# EasyEDA Pro project avaruusantenni_tallylight.eprj, schematic Schematic2

## Sheets
1 MCU: Create Date: 2023-10-17; Page Name: MCU; Project Name: avaruusantenni_tallylight; Schematic Name: Schematic2; Update Date: 2023-12-20; Add into BOM: no; Company: EasyEDA.com; Drawed: EasyEDA Pro; Page Size: A4; Part Number: JLCPCB-002; Reviewed: EasyEDA Pro; Version: V0.1
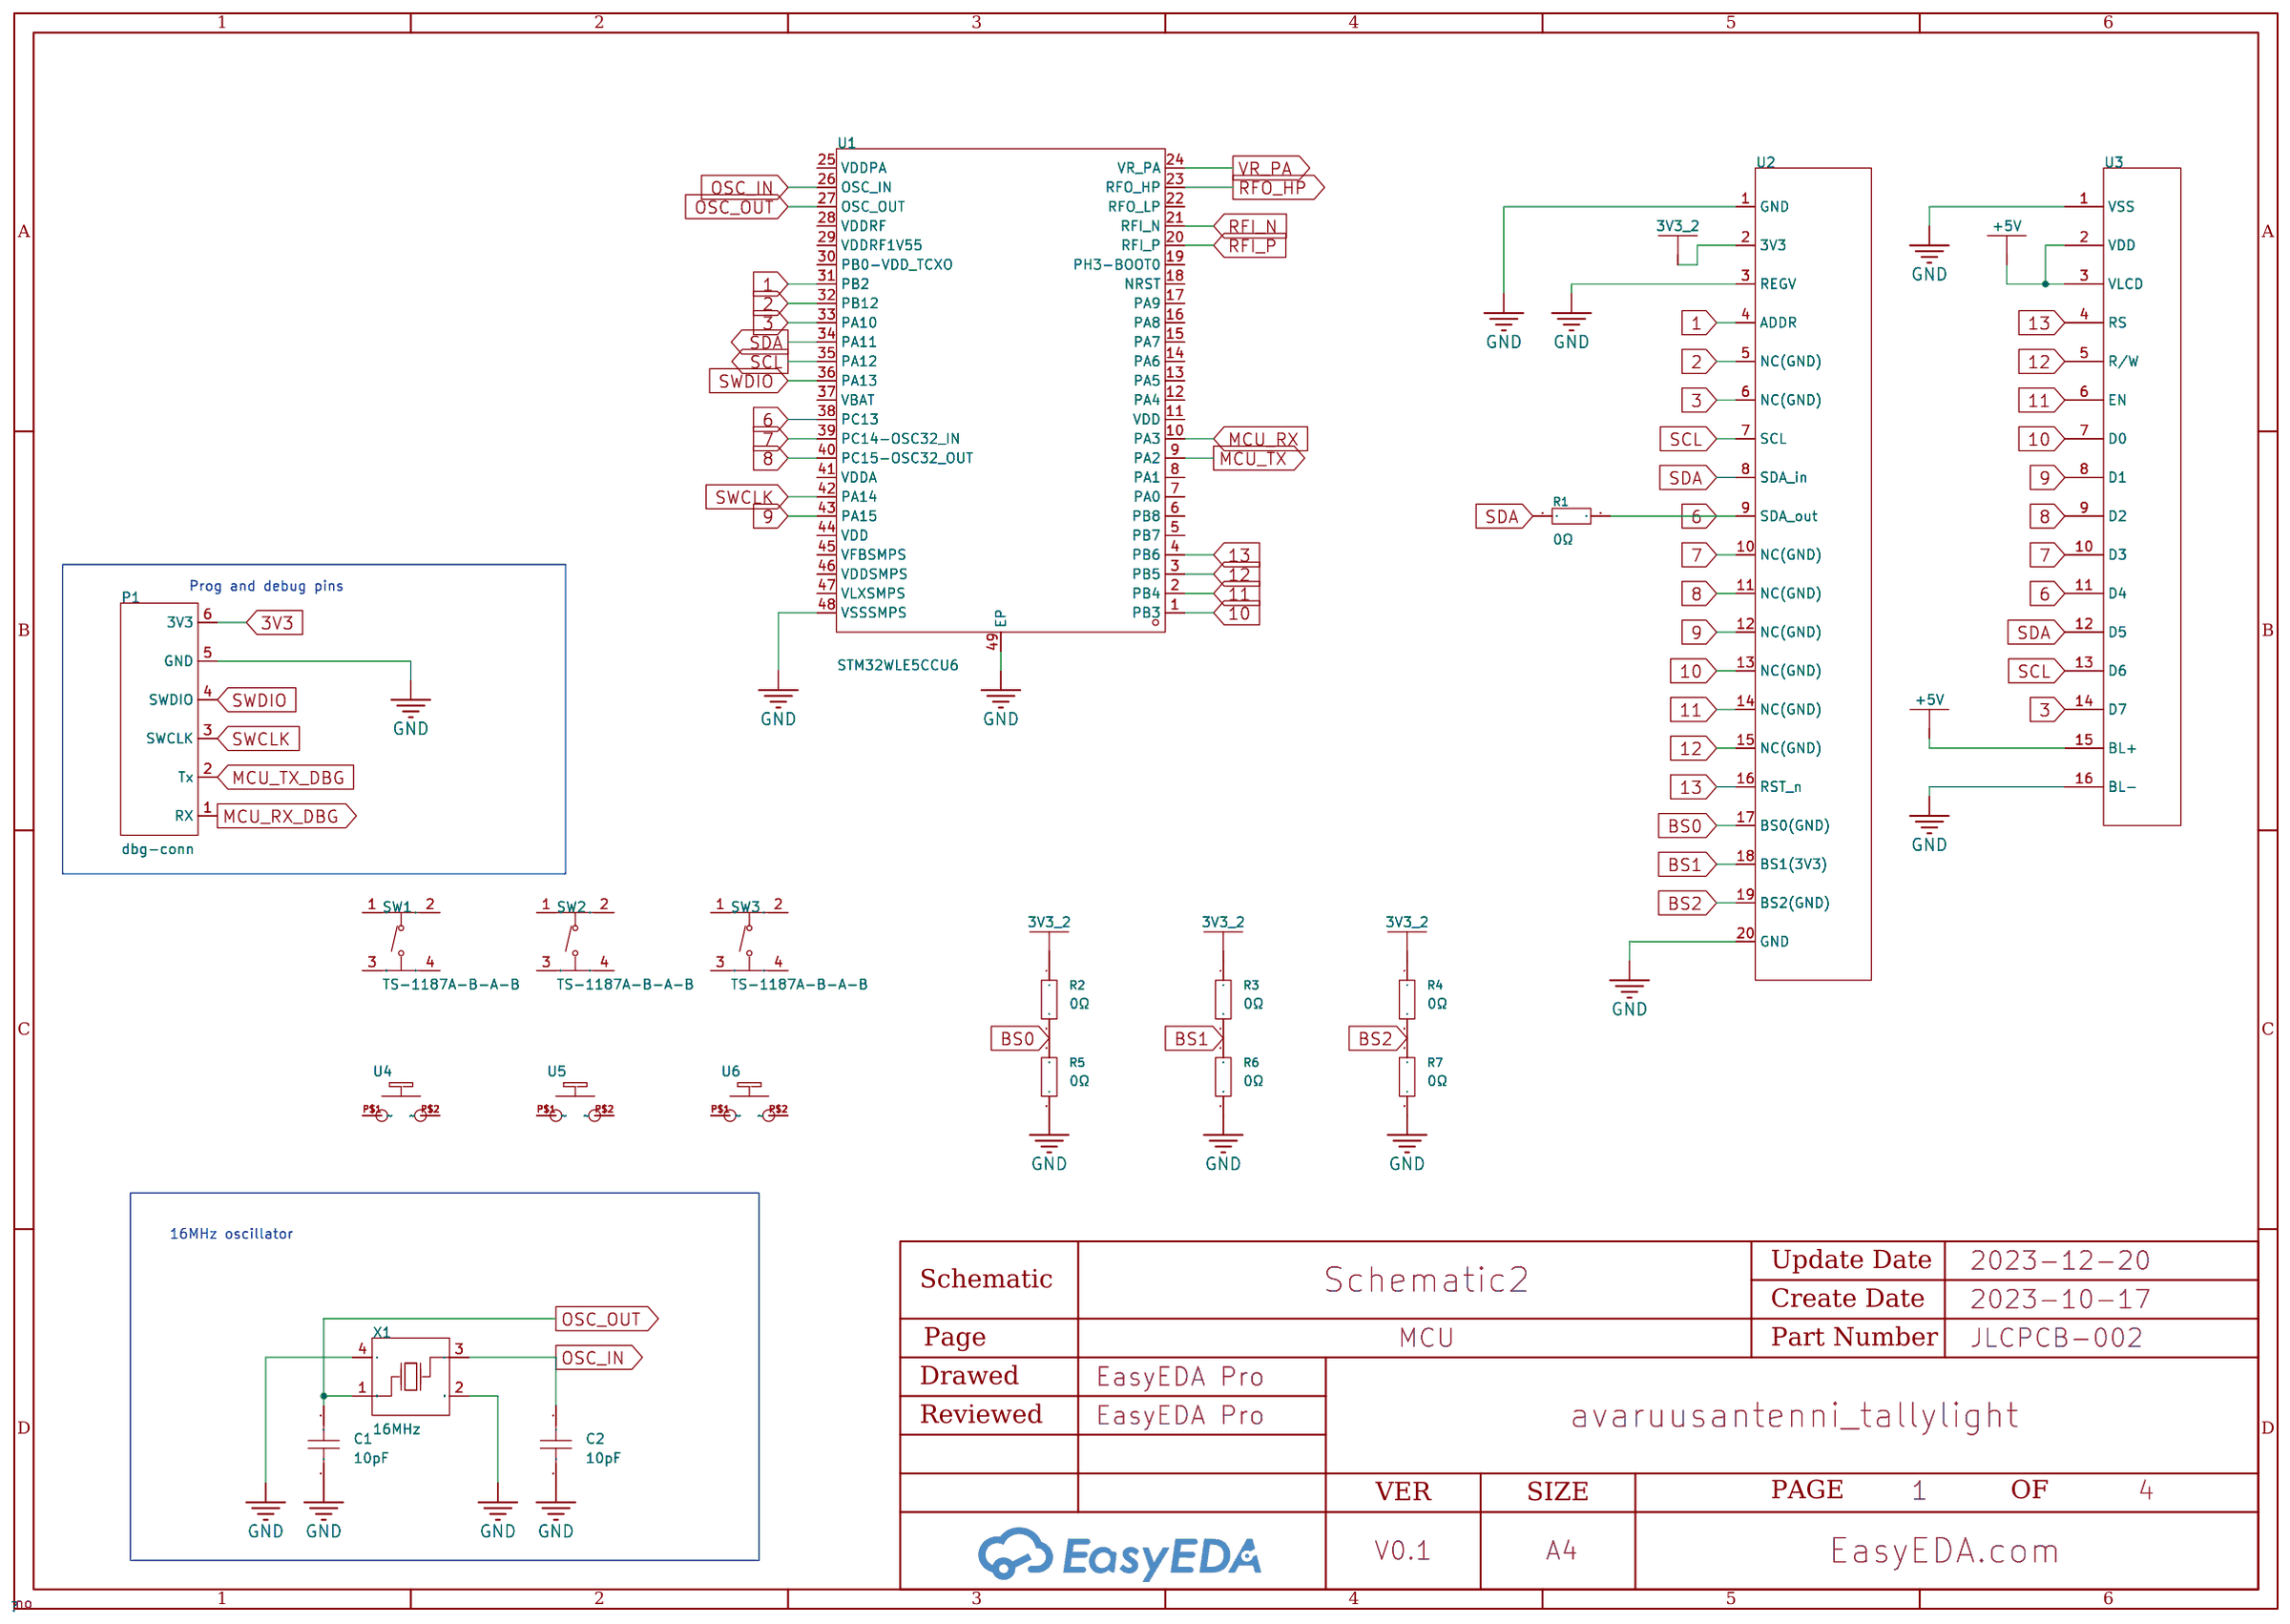
[diagram p3: MCU]
2 PWR: Page Name: PWR; Update Date: 2023-11-27
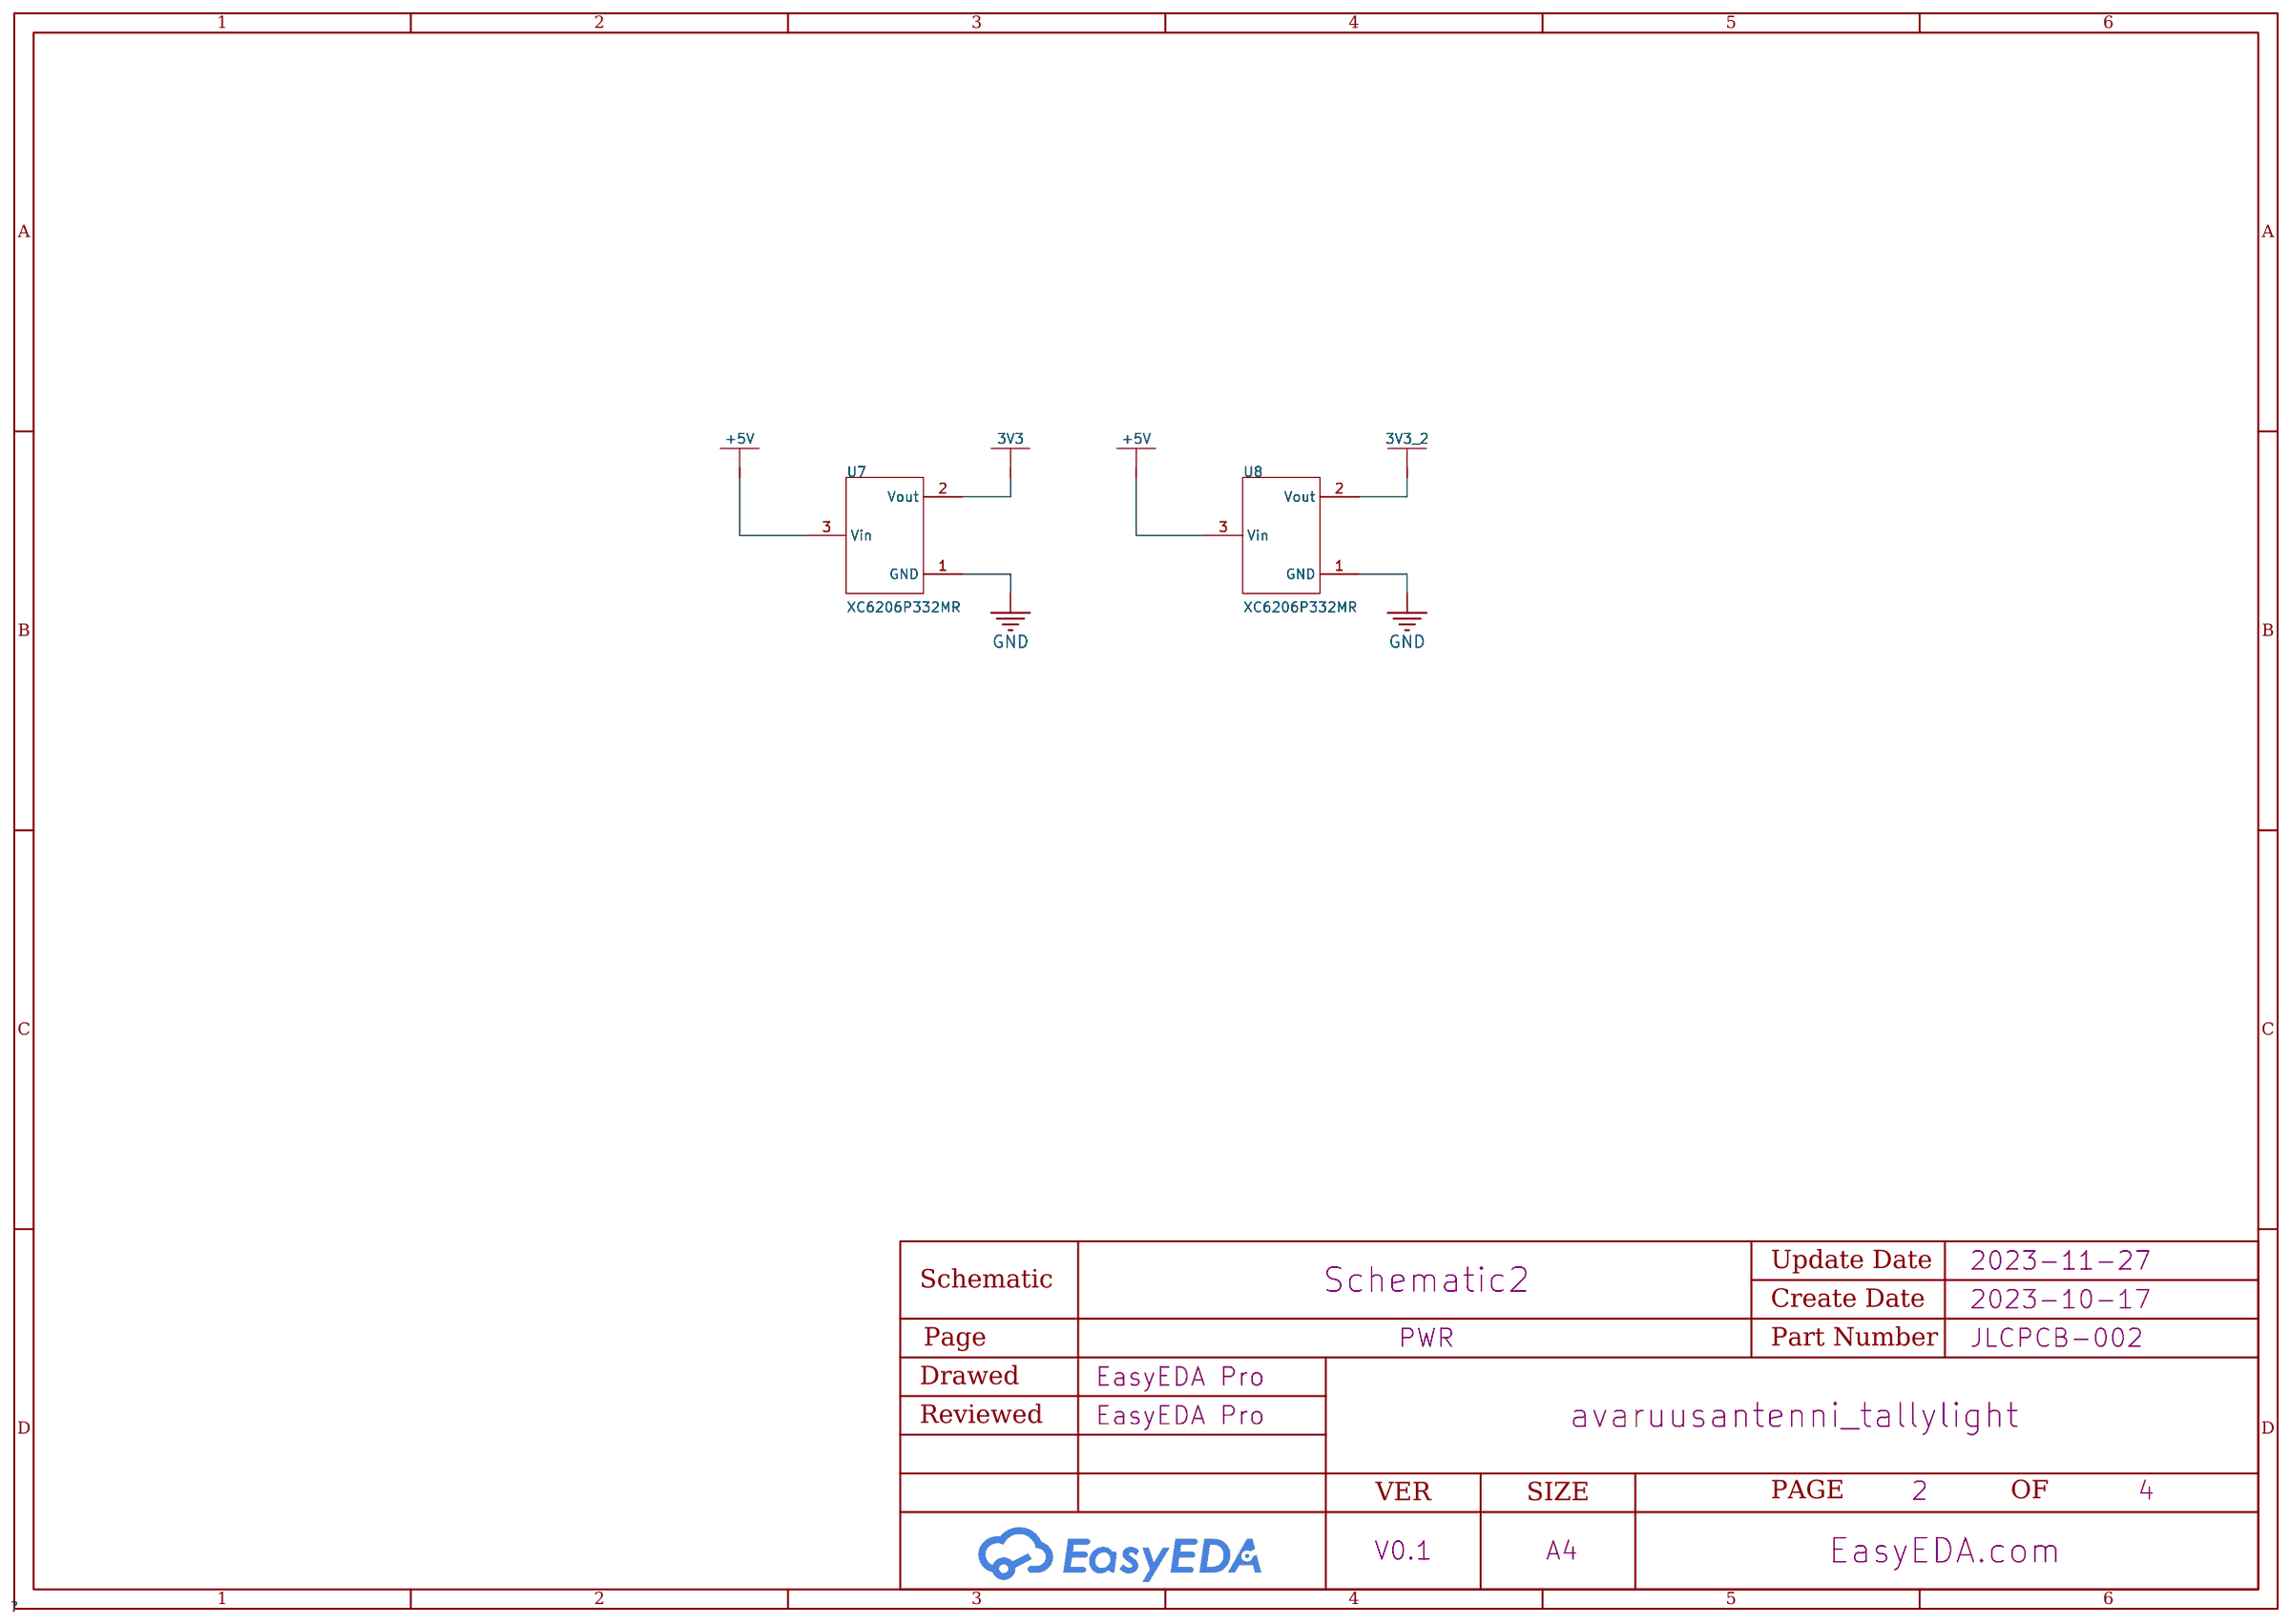
[diagram p4: PWR]
3 Serial: Page Name: Serial; Update Date: 2023-10-28
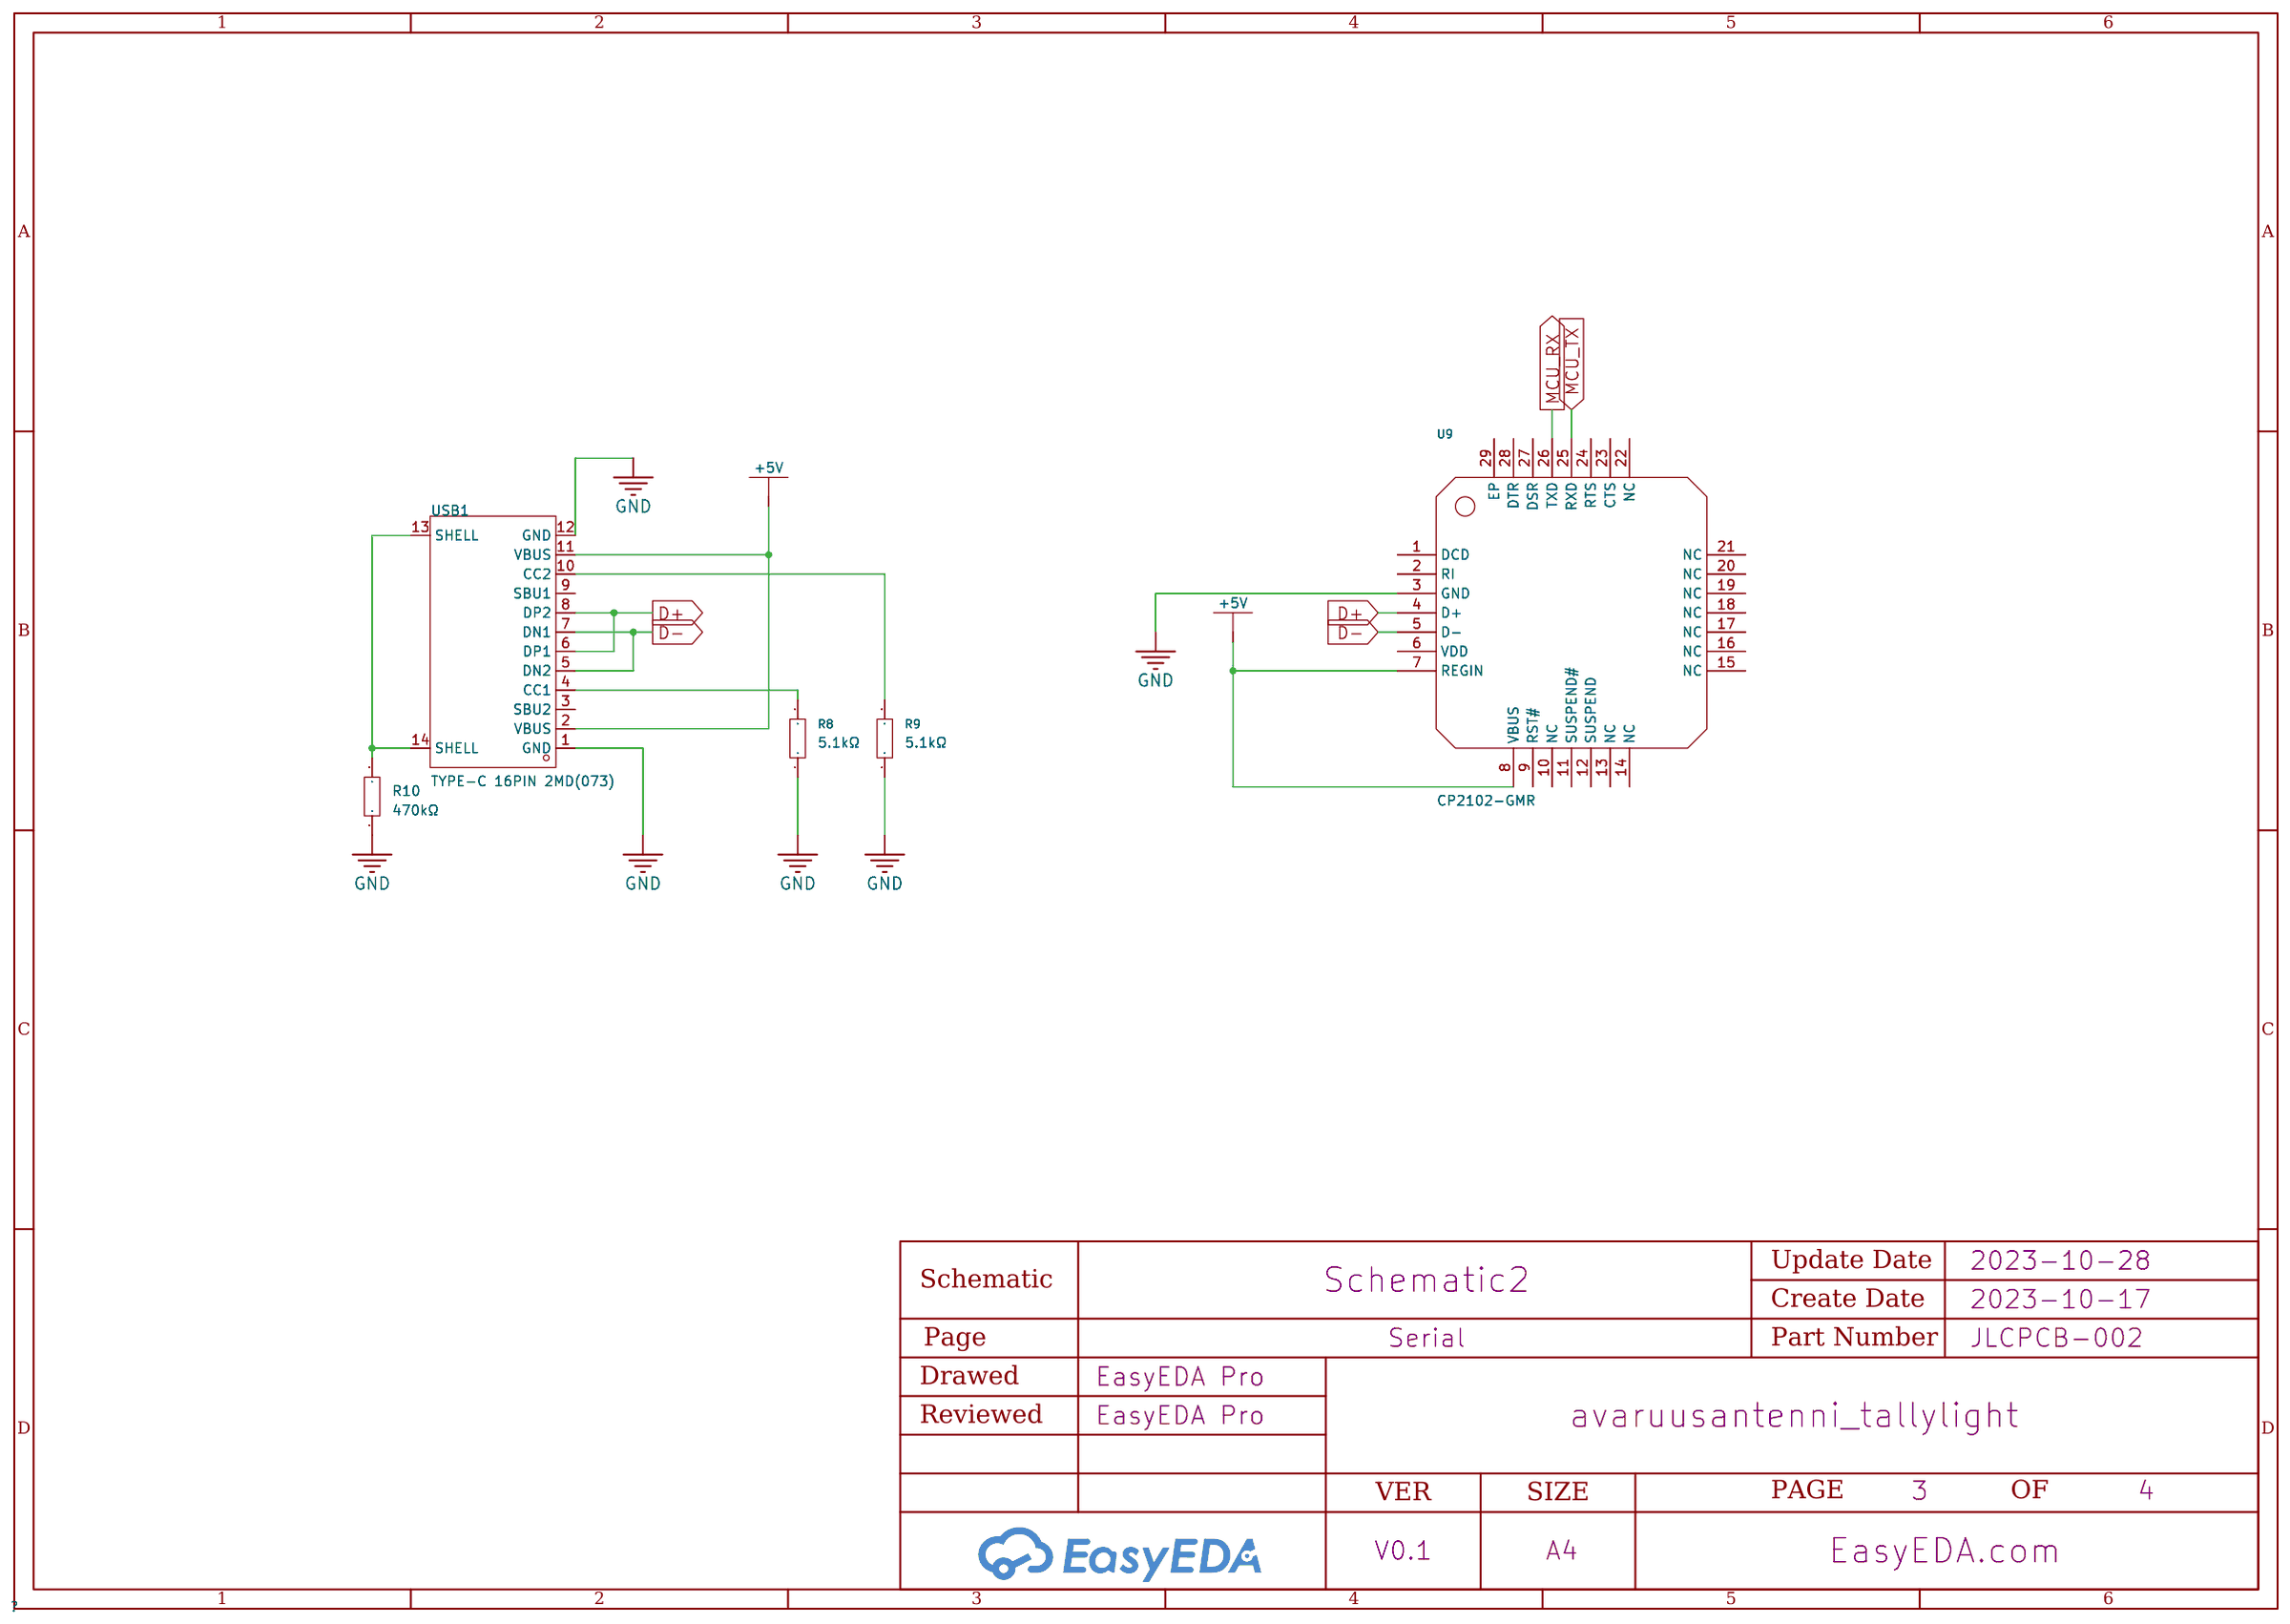
[diagram p5: Serial]
4 RF_Front: Page Name: RF_Front; Update Date: 2023-12-21
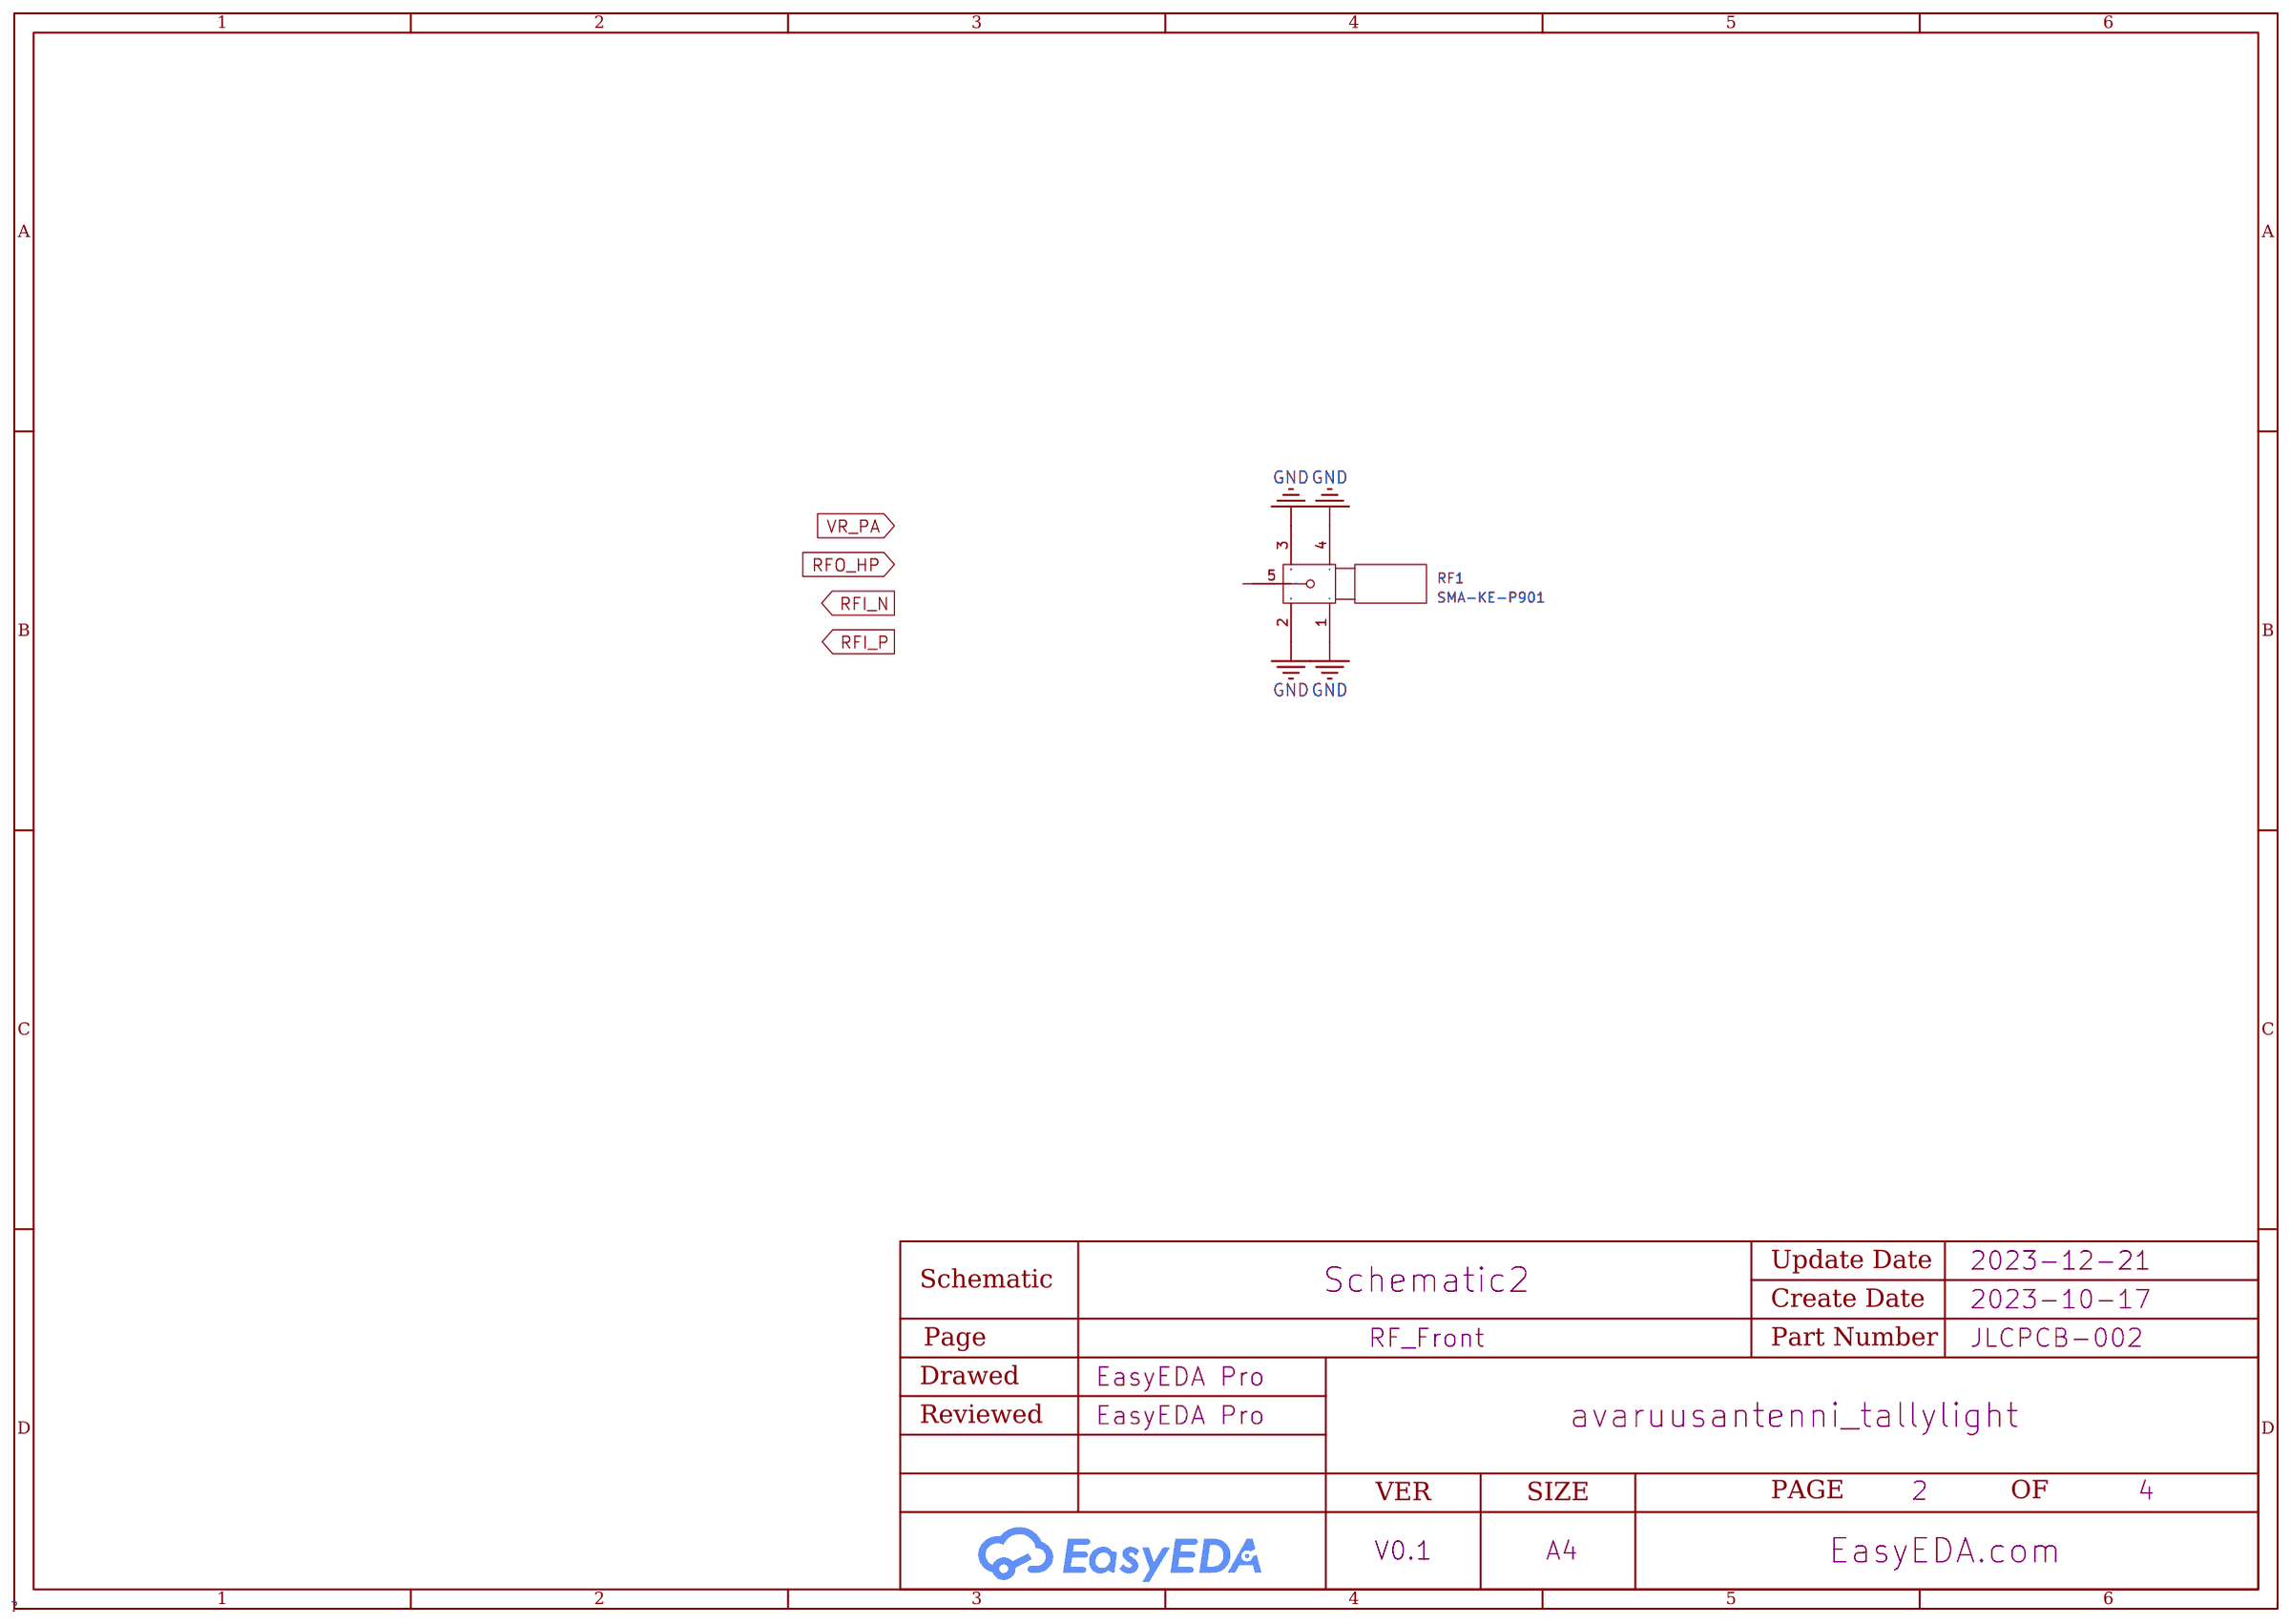
[diagram p6: RF_Front]

## Parts
sheet MCU
C1  10pF  [C0402]
C2  10pF  [C0402]
P1  dbg-conn  [AA-DBG-1x6-2.54]  (no BOM)
R1  0Ω  [R0603]
R2  0Ω  [R0603]  (no BOM)
R3  0Ω  [R0603]
R4  0Ω  [R0603]  (no BOM)
R5  0Ω  [R0603]
R6  0Ω  [R0603]  (no BOM)
R7  0Ω  [R0603]
SW1  TS-1187A-B-A-B  [SW-SMD_4P-L5.1-W5.1-P3.70-LS6.5-TL-2]
SW2  TS-1187A-B-A-B  [SW-SMD_4P-L5.1-W5.1-P3.70-LS6.5-TL-2]
SW3  TS-1187A-B-A-B  [SW-SMD_4P-L5.1-W5.1-P3.70-LS6.5-TL-2]
U1  STM32WLE5CCU6  [UFQFPN-48_L7.0-W7.0-P0.50-BL-EP5.6]
U2  -  [NewhavenOledModule]  (no BOM)
U3  -  [LCD_1602A]
U4  MX1A-11NN  [CHERRY_MX1A-11NN_SWITCH]  (no BOM)
U5  MX1A-11NN  [CHERRY_MX1A-11NN_SWITCH]  (no BOM)
U6  MX1A-11NN  [CHERRY_MX1A-11NN_SWITCH]  (no BOM)
X1  16MHz  [OSC-SMD_4P-L3.2-W2.5-BL]
sheet PWR
U7  XC6206P332MR  [SOT-23-3_L2.9-W1.6-P1.90-LS2.8-BR]
U8  XC6206P332MR  [SOT-23-3_L2.9-W1.6-P1.90-LS2.8-BR]
sheet RF_Front
CBB1  b29a9d25234149e2a3663a5b9bef8dd2
RF1  SMA-KE-P901  [SMA-TH_SMA-KE-P901]  (no BOM)
sheet Serial
R8  5.1kΩ  [R0402]
R9  5.1kΩ  [R0402]
R10  470kΩ  [R0603]
U9  CP2102-GMR  [WQFN-28_L5.0-W5.0-P0.50-BL-EP3.2]
USB1  TYPE-C 16PIN 2MD(073)  [USB-C-SMD_TYPE-C-6PIN-2MD-073]

## Library data of the parts
C1 C2 = CL05C100JB5NNNC: Capacitance: Tolerance:±5% Tolerance:±5% Voltage Rated: Temperature Coefficient:; LCSC Part Name: 10pF ±5% 50V; Supplier Part: C32949; Manufacturer: SAMSUNG(三星); Supplier Footprint: 0402; JLCPCB Part Class: Basic Part; Datasheet: https://atta.szlcsc.com/upload/public/pdf/source/20160103/1457707722238.pdf; Supplier: LCSC; Tolerance: ±5%
P1 = AA-DBG-1x6-L: The Avaruusantenni standard debug connector variant with a pin layout of 1 x 6 with 2.54 mm (100 mil) pitch
R1-R7 = 0603WAF0000T5E: Resistance: Tolerance:±1% Tolerance:±1% Power(Watts): Overload Voltage (Max): Type:Thick Film Resistors Operating Temperature Range:-55℃~+155℃ Operating Temperature Range:-55℃~+155℃; LCSC Part Name: 0Ω ±1% 100mW 厚膜电阻; Supplier Part: C21189; Manufacturer: UNI-ROYAL(厚声); Supplier Footprint: 0603; JLCPCB Part Class: Basic Part; Datasheet: https://atta.szlcsc.com/upload/public/pdf/source/20200306/C422600_1E6D84923E4A46A82E41ADD87F860B5C.pdf; Supplier: LCSC; Tolerance: ±1%; Type: Thick Film Resistors; Operating Temperature Range: -55℃~+155℃
SW1-SW3 = TS-1187A-B-A-B: Contact Current:50mA Voltage Rating (DC):12V Insulation Resistance:- Circuit:SPST Mounting Style:Brick nogging Actuator Style:Round Button Actuator/Cap Color:金色 With Lamp:No Operating Force:160gf Mechanical Life:100000次 Operating Temperature:-30℃~+85℃ Ope; LCSC Part Name: 5.1*5.1*1.5mm 立贴 轻触开关 防水金属头; Supplier Part: C318884; Manufacturer: XKB Connectivity(中国星坤); Supplier Footprint: SMD; JLCPCB Part Class: Basic Part; Datasheet: https://atta.szlcsc.com/upload/public/pdf/source/20200227/C318884_1F20165719E1C4CAA3E10C4C359C6E26.pdf; Supplier: LCSC; Contact Current: 50mA; Voltage Rating (DC): 12V; Circuit: SPST; Mounting Style: Brick nogging; Actuator Style: Round Button; Actuator/Cap Color: 金色; With Lamp: No; Operating Force: 160gf; Mechanical Life: 100000次; Operating Temperature: -30℃~+85℃; Switch Length: 5.1mm; Switch Width: 5.1mm; Switch Height: 1.5mm; Strike Gundam: NO
U1 = STM32WLE5CCU6: Supplier Part: C2888218; Manufacturer: ST(意法半导体); Supplier Footprint: UFQFPN-48(7x7); JLCPCB Part Class: Extended Part; Datasheet: https://atta.szlcsc.com/upload/public/pdf/source/20220805/73C544F8A874B6EECCDD18E2DF490EB3.pdf; Supplier: LCSC
U2 = NewhavenOled_i2c: i2c version of the 2x20 character oled module, 3.3V
U3 = LCD_1602A: 16x2 character parallel interface LCD module
U4-U6 = MX1A-11NN: \nSwitch,Key,SPST-NO,Keyboard,Low Profile,10mA,12VDC,Face Place Mount,Std Force | Cherry Americas MX1A-11NN\n; MF: Cherry; Price: None; SnapEDA_Link: https://www.snapeda.com/parts/MX1A-11NN/Cherry/view-part/?ref=snap; Purchase-URL: https://www.snapeda.com/api/url_track_click_mouser/?unipart_id=283337&amp;manufacturer=Cherry&amp;part_name=MX1A-11NN&amp;search_term=none; Availability: In Stock; Check_prices: https://www.snapeda.com/parts/MX1A-11NN/Cherry/view-part/?ref=eda
X1 = X322516MLB4SI: Crystal Type:SMD Crystal Resonator Frequency: Frequency Tolerance:±10ppm Frequency Tolerance:±10ppm Frequency Stability:±30ppm Frequency Stability:±30ppm Load Capacitance: Operating Temperature: Operating Temperature:; LCSC Part Name: 16MHz ±10ppm 9pF YSX321SL; Supplier Part: C13738; Manufacturer: YXC(扬兴晶振); Supplier Footprint: SMD3225-4P; JLCPCB Part Class: Basic Part; Datasheet: https://atta.szlcsc.com/upload/public/pdf/source/20210329/C112971_1F611BDC486E193C1706F6D8EB5AA189.pdf; Supplier: LCSC; Crystal Type: SMD Crystal Resonator; Frequency Tolerance: ±10ppm; Frequency Stability: ±30ppm
U7 U8 = XC6206P332MR_C5446: Output Type: Output Polarity:Positive Number of Outputs:1 Maximum Input Voltage:6V Output Voltage:3.3V~3.3V Output Voltage:3.3V~3.3V Dropout Voltage:680mV@(100mA) Output Current:200mA Power Supply Rejection Ratio (PSRR):-; Supplier Part: C5446; Manufacturer: TOREX(特瑞仕); Supplier Footprint: SOT-23-3L; JLCPCB Part Class: Basic Part; Datasheet: https://atta.szlcsc.com/upload/public/pdf/source/20130801/1457706628791.pdf; Supplier: LCSC; Output Polarity: Positive; Number of Outputs: 1; Maximum Input Voltage: 6V; Output Voltage: 3.3V~3.3V; Dropout Voltage: 680mV@(100mA); Output Current: 200mA
RF1 = SMA-KE-P901: Connector Type:板端 RF Series:RP-SMA Interface Type:内针 Number of Ports:1 Impedance:50Ω Frequency-Max:3GHz Style:偏脚 Interface Diameter:5.35mm Interface Length/Height:- Operating Temperature Range:-55℃~+125℃ Operating Temperature Range:-55℃~+125℃; LCSC Part Name: RP-SMA 内针 偏脚; Supplier Part: C914556; Manufacturer: DreamLNK(骏晔科技); Supplier Footprint: 插件; JLCPCB Part Class: Extended Part; Datasheet: https://atta.szlcsc.com/upload/public/pdf/source/20201104/C914556_6716DB066E64EC6AFA3017BF070429A4.pdf; Supplier: LCSC; Connector Type: 板端; RF Series: RP-SMA; Interface Type: 内针; Number of Ports: 1; Impedance: 50Ω; Frequency-Max: 3GHz; Style: 偏脚; Interface Diameter: 5.35mm; Operating Temperature Range: -55℃~+125℃
R8 R9 = 0402WGF5101TCE: Type:Thick Film Resistors Resistance: Tolerance:±1% Tolerance:±1% Power(Watts): Temperature Coefficient:±100ppm/℃ Temperature Coefficient:±100ppm/℃ Overload Voltage (Max): Operating Temperature Range:-55℃~+155℃ Operating Temperature Range:-55℃~+155℃; LCSC Part Name: 5.1kΩ ±1% 62.5mW; Supplier Part: C25905; Manufacturer: UNI-ROYAL(厚声); Supplier Footprint: 0402; JLCPCB Part Class: Basic Part; Datasheet: https://atta.szlcsc.com/upload/public/pdf/source/20200306/C422600_1E6D84923E4A46A82E41ADD87F860B5C.pdf; Supplier: LCSC; Type: Thick Film Resistors; Tolerance: ±1%; Temperature Coefficient: ±100ppm/℃; Operating Temperature Range: -55℃~+155℃
R10 = 0603WAF4703T5E: Type:Thick Film Resistors Resistance: Tolerance:±1% Tolerance:±1% Power(Watts): Temperature Coefficient:±100ppm/℃ Temperature Coefficient:±100ppm/℃ Overload Voltage (Max): Operating Temperature Range:-55℃~+155℃ Operating Temperature Range:-55℃~+155℃; LCSC Part Name: 470kΩ ±1% 100mW; Supplier Part: C23178; Manufacturer: UNI-ROYAL(厚声); Supplier Footprint: 0603; JLCPCB Part Class: Basic Part; Datasheet: https://atta.szlcsc.com/upload/public/pdf/source/20200306/C422600_1E6D84923E4A46A82E41ADD87F860B5C.pdf; Supplier: LCSC; Type: Thick Film Resistors; Tolerance: ±1%; Temperature Coefficient: ±100ppm/℃; Operating Temperature Range: -55℃~+155℃
U9 = CP2102-GMR: Applications Function:Transceiver Protocol: Data Rate:1Mbps Supply Voltage:3V~3.6V Supply Voltage:3V~3.6V; Supplier Part: C6568; Manufacturer: SILICON LABS(芯科); Supplier Footprint: WQFN-28-EP(5x5); JLCPCB Part Class: Basic Part; Datasheet: https://atta.szlcsc.com/upload/public/pdf/source/20170103/1483439882795.pdf; Supplier: LCSC; Applications Function: Transceiver; Data Rate: 1Mbps; Supply Voltage: 3V~3.6V
USB1 = TYPE-C 16PIN 2MD(073): Connector Type:Type-C Standard:- Gender:Female Number of Contacts:16 Number of Ports:1 Mounting Style:Surface Mount Current Rating - Power (Max):5A Operating Temperature Range:-25℃~+85℃ Operating Temperature Range:-25℃~+85℃; LCSC Part Name: TYPE-C母座 16P 4脚插件带定位柱 不锈钢外壳 2次模顶; Supplier Part: C2765186; Manufacturer: SHOU HAN(首韩); Supplier Footprint: SMD; JLCPCB Part Class: Extended Part; Supplier: LCSC; Connector Type: Type-C; Gender: Female; Number of Contacts: 16; Number of Ports: 1; Mounting Style: Surface Mount; Current Rating - Power (Max): 5A; Operating Temperature Range: -25℃~+85℃

## Nets
3V3: P1.6(3V3) U7.2(Vout)
3V3_2: R2.1 R3.1 R4.1 U2.2(3V3) U8.2(Vout)
+5V: U3.2(VDD) U3.3(VLCD) U3.15(BL+) U7.3(Vin) U8.3(Vin) U9.7(REGIN) U9.8(VBUS) USB1.2(VBUS) USB1.11(VBUS)
GND: C1.1 C2.2 P1.5(GND) R5.2 R6.2 R7.2 R8.1 R9.1 R10.1 RF1.1 RF1.2 RF1.3 RF1.4 U1.48(VSSSMPS) U1.49(EP) U2.1(GND) U2.3(REGV) U2.20(GND) U3.1(VSS) U3.16(BL-) U7.1(GND) U8.1(GND) U9.3(GND) USB1.1(GND) USB1.12(GND) X1.2(GND) X1.4(GND)
1: U1.31(PB2) U2.4(ADDR)
2: U1.32(PB12) U2.5(NC(GND))
3: U1.33(PA10) U2.6(NC(GND)) U3.14(D7)
6: R1.2 U1.38(PC13) U2.9(SDA_out) U3.11(D4)
7: U1.39(PC14-OSC32_IN) U2.10(NC(GND)) U3.10(D3)
8: U1.40(PC15-OSC32_OUT) U2.11(NC(GND)) U3.9(D2)
9: U1.43(PA15) U2.12(NC(GND)) U3.8(D1)
10: U1.1(PB3) U2.13(NC(GND)) U3.7(D0)
11: U1.2(PB4) U2.14(NC(GND)) U3.6(EN)
12: U1.3(PB5) U2.15(NC(GND)) U3.5(R/W)
13: U1.4(PB6) U2.16(RST_n) U3.4(RS)
BS0: R2.2 R5.1 U2.17(BS0(GND))
BS1: R3.2 R6.1 U2.18(BS1(3V3))
BS2: R4.2 R7.1 U2.19(BS2(GND))
D+: U9.4(D+) USB1.6(DP1) USB1.8(DP2)
D-: U9.5(D-) USB1.5(DN2) USB1.7(DN1)
MCU_RX: U1.10(PA3) U9.26(TXD)
MCU_RX_DBG: P1.1(RX)
MCU_TX: U1.9(PA2) U9.25(RXD)
MCU_TX_DBG: P1.2(Tx)
OSC_IN: C2.1 U1.26(OSC_IN) X1.3(OSC2)
OSC_OUT: C1.2 U1.27(OSC_OUT) X1.1(OSC1)
RFI_N: CBB1.(ANT) RF1.5 U1.20(RFI_P) U1.21(RFI_N) U1.23(RFO_HP) U1.24(VR_PA)
SCL: U1.35(PA12) U2.7(SCL) U3.13(D6)
SDA: R1.1 U1.34(PA11) U2.8(SDA_in) U3.12(D5)
SWCLK: P1.3(SWCLK) U1.42(PA14)
SWDIO: P1.4(SWDIO) U1.36(PA13)
$3N555: R9.2 USB1.10(CC2)
$3N562: R8.2 USB1.4(CC1)
$3N1134: R10.2 USB1.13(SHELL) USB1.14(SHELL)

Not connected (* = marked no-connect by the designer): SW1 1(A) 2(B) 3(C) 4(D); SW2 1(A) 2(B) 3(C) 4(D); SW3 1(A) 2(B) 3(C) 4(D); U1 5(PB7) 6(PB8) 7(PA0) 8(PA1) 11(VDD) 12(PA4) 13(PA5) 14(PA6) 15(PA7) 16(PA8) 17(PA9) 18(NRST) 19(PH3-BOOT0) 22(RFO_LP) 25(VDDPA) 28(VDDRF) 29(VDDRF1V55) 30(PB0-VDD_TCXO) 37(VBAT) 41(VDDA) 44(VDD) 45(VFBSMPS) 46(VDDSMPS) 47(VLXSMPS); U4 P$1 P$2; U5 P$1 P$2; U6 P$1 P$2; U9 1(DCD) 2(RI) 6(VDD) 9(RST#) 10(NC) 11(SUSPEND#) 12(SUSPEND) 13(NC) 14(NC) 15(NC) 16(NC) 17(NC) 18(NC) 19(NC) 20(NC) 21(NC) 22(NC) 23(CTS) 24(RTS) 27(DSR) 28(DTR) 29(EP); USB1 3(SBU2) 9(SBU1)

## Notes on the sheets
sheet 1
- Prog and debug pins
- 16MHz oscillator
